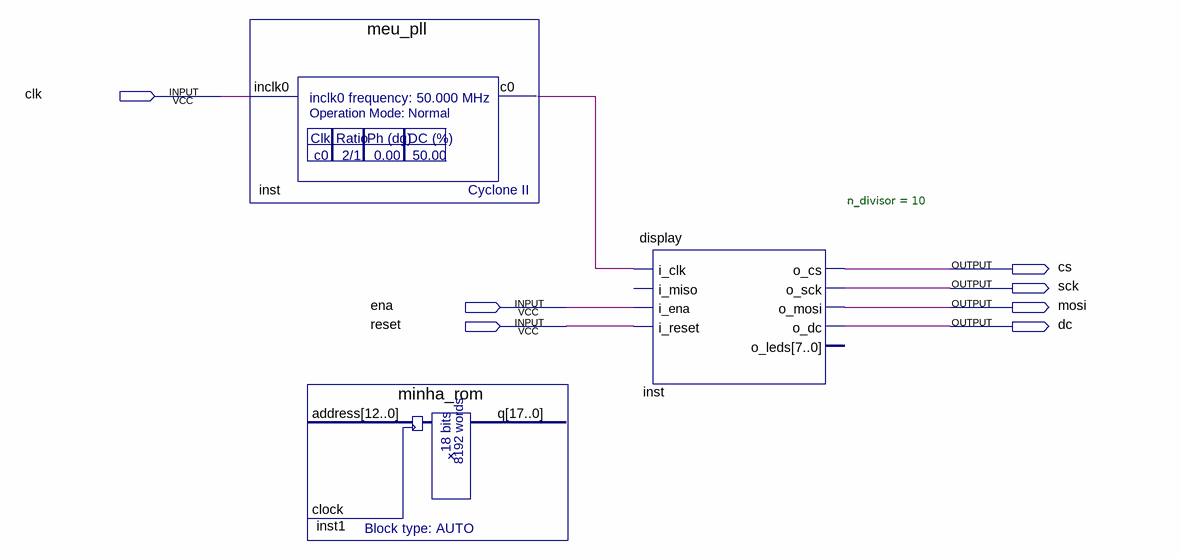
[diagram p0: schematic sheet]
// Quartus schematic top.bdf as structural Verilog: 3 symbols, 7 pins
module top (
  input  clk,
  input  ena,
  input  reset,
  output cs,
  output sck,
  output mosi,
  output dc
);

  wire inst_c0;

  meu_pll inst (.inclk0(clk), .c0(inst_c0));
  minha_rom inst1 ();  // open: address, clock, q
  display #(.n_divisor(10)) inst_dup2 (
    .i_clk(inst_c0), .i_ena(ena), .i_reset(reset), .o_cs(cs), .o_sck(sck), .o_mosi(mosi), .o_dc(dc));  // open: i_miso, o_leds
endmodule
